# Altium schematic sheet DiffMeasure.SchDoc
size A4
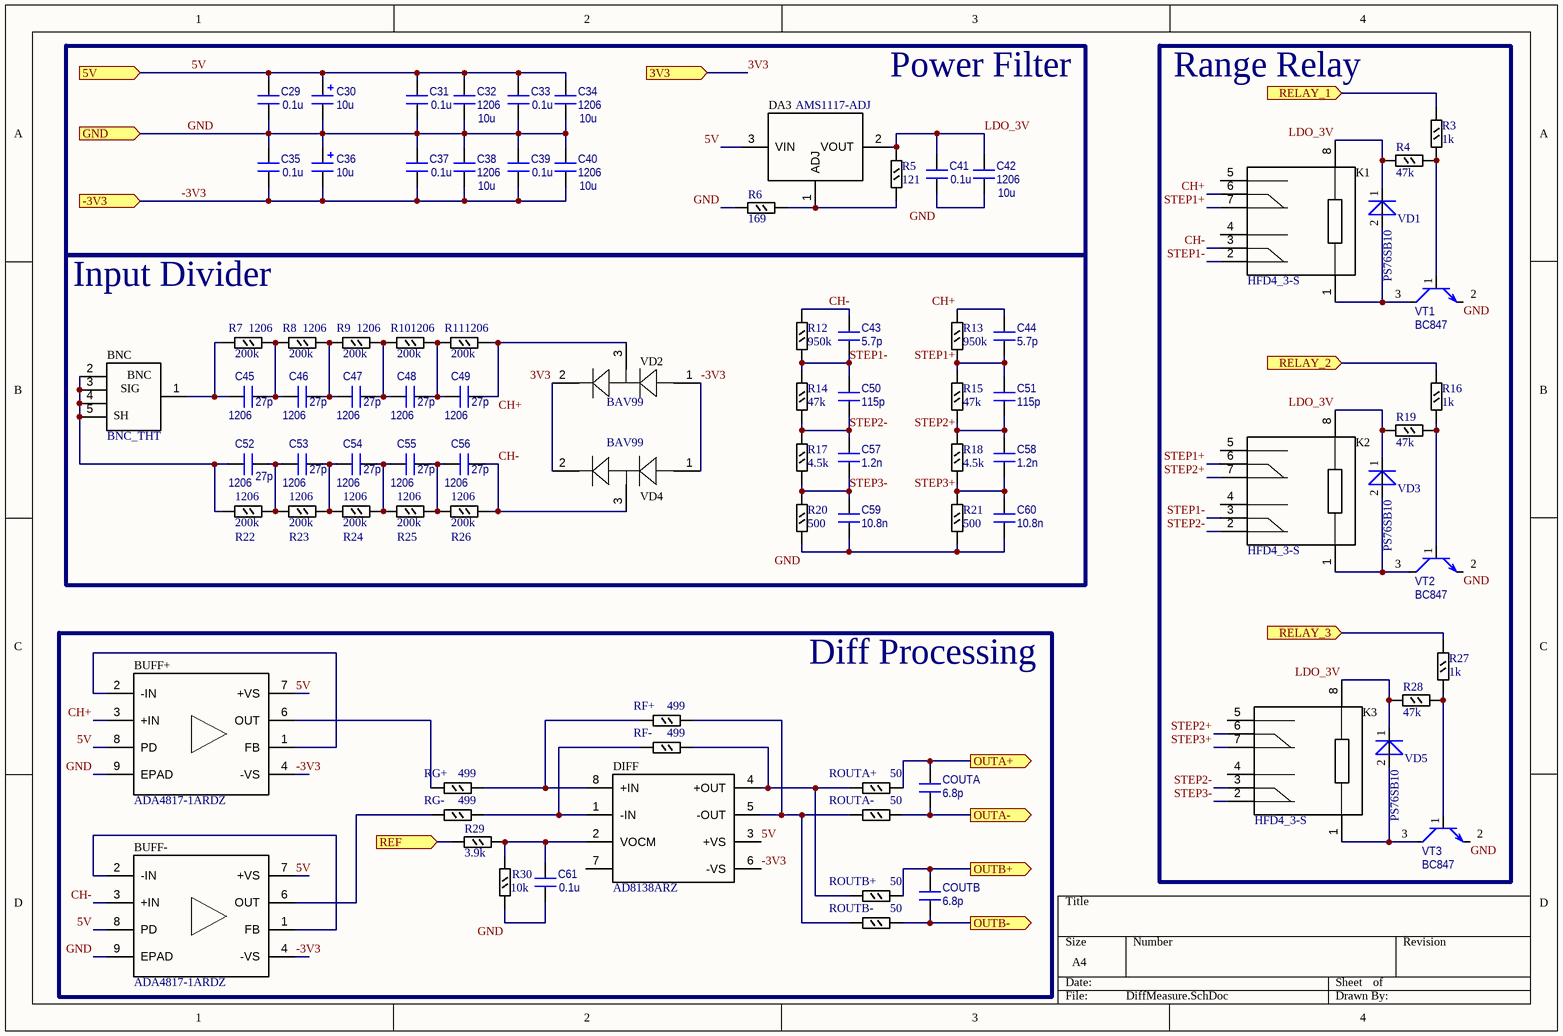
[diagram p0: DiffMeasure.SchDoc]

## Parts
BNC  BNC_THT  [BNC_VERTICAL_THT_5PIN]
BUFF+  ADA4817-1ARDZ  [ADA4817-1ARDZ_SOIC8_EP]
BUFF-  ADA4817-1ARDZ  [ADA4817-1ARDZ_SOIC8_EP]
C29  value 0.1u  [CAPC2012(0805)N]
C30  10u  [CAPMP7343X310N]
C31  value 0.1u  [CAPC2012(0805)N]
C32  value 10u  Package: 1206  [CAP_CER_1206]  (hidden comment: 2700p 50V)
C33  value 0.1u  [CAPC2012(0805)N]
C34  value 10u  Package: 1206  [CAP_CER_1206]  (hidden comment: 2700p 50V)
C35  value 0.1u  [CAPC2012(0805)N]
C36  10u  [CAPMP7343X310N]
C37  value 0.1u  [CAPC2012(0805)N]
C38  value 10u  Package: 1206  [CAP_CER_1206]  (hidden comment: 2700p 50V)
C39  value 0.1u  [CAPC2012(0805)N]
C40  value 10u  Package: 1206  [CAP_CER_1206]  (hidden comment: 2700p 50V)
C41  value 0.1u  [CAPC2012(0805)N]
C42  value 10u  Package: 1206  [CAP_CER_1206]  (hidden comment: 2700p 50V)
C43  value 5.7p  [CAPC2012(0805)N]
C44  value 5.7p  [CAPC2012(0805)N]
C45  value 27p  Package: 1206  [CAP_CER_1206]  (hidden comment: 2700p 50V)
C46  value 27p  Package: 1206  [CAP_CER_1206]  (hidden comment: 2700p 50V)
C47  value 27p  Package: 1206  [CAP_CER_1206]  (hidden comment: 2700p 50V)
C48  value 27p  Package: 1206  [CAP_CER_1206]  (hidden comment: 2700p 50V)
C49  value 27p  Package: 1206  [CAP_CER_1206]  (hidden comment: 2700p 50V)
C50  value 115p  [CAPC2012(0805)N]
C51  value 115p  [CAPC2012(0805)N]
C52  value 27p  Package: 1206  [CAP_CER_1206]  (hidden comment: 2700p 50V)
C53  value 27p  Package: 1206  [CAP_CER_1206]  (hidden comment: 2700p 50V)
C54  value 27p  Package: 1206  [CAP_CER_1206]  (hidden comment: 2700p 50V)
C55  value 27p  Package: 1206  [CAP_CER_1206]  (hidden comment: 2700p 50V)
C56  value 27p  Package: 1206  [CAP_CER_1206]  (hidden comment: 2700p 50V)
C57  value 1.2n  [CAPC2012(0805)N]
C58  value 1.2n  [CAPC2012(0805)N]
C59  value 10.8n  [CAPC2012(0805)N]
C60  value 10.8n  [CAPC2012(0805)N]
C61  value 0.1u  [CAPC2012(0805)N]
COUTA  value 6.8p  [CAPC2012(0805)N]
COUTB  value 6.8p  [CAPC2012(0805)N]
DA3  AMS1117-ADJ  [AMS1117-ADJ_SOT223]
DIFF  AD8138ARZ  [AD8138ARZ_SOIC8]
K1  HFD4_3-S  [HFD4_3_S_SMT]
K2  HFD4_3-S  [HFD4_3_S_SMT]
K3  HFD4_3-S  [HFD4_3_S_SMT]
R3  1k  [RESC2012(0805)N]
R4  47k  [RESC2012(0805)N]
R5  121  [RESC2012(0805)N]
R6  169  [RESC2012(0805)N]
R7  200k  Package: 1206  [R_1206]
R8  200k  Package: 1206  [R_1206]
R9  200k  Package: 1206  [R_1206]
R10  200k  Package: 1206  [R_1206]
R11  200k  Package: 1206  [R_1206]
R12  950k  [RESC2012(0805)N]
R13  950k  [RESC2012(0805)N]
R14  47k  [RESC2012(0805)N]
R15  47k  [RESC2012(0805)N]
R16  1k  [RESC2012(0805)N]
R17  4.5k  [RESC2012(0805)N]
R18  4.5k  [RESC2012(0805)N]
R19  47k  [RESC2012(0805)N]
R20  500  [RESC2012(0805)N]
R21  500  [RESC2012(0805)N]
R22  200k  Package: 1206  [R_1206]
R23  200k  Package: 1206  [R_1206]
R24  200k  Package: 1206  [R_1206]
R25  200k  Package: 1206  [R_1206]
R26  200k  Package: 1206  [R_1206]
R27  1k  [RESC2012(0805)N]
R28  47k  [RESC2012(0805)N]
R29  3.9k  [RESC2012(0805)N]
R30  10k  [RESC2012(0805)N]
RF+  499  [RESC2012(0805)N]
RF-  499  [RESC2012(0805)N]
RG+  499  [RESC2012(0805)N]
RG-  499  [RESC2012(0805)N]
ROUTA+  50  [RESC2012(0805)N]
ROUTA-  50  [RESC2012(0805)N]
ROUTB+  50  [RESC2012(0805)N]
ROUTB-  50  [RESC2012(0805)N]
VD1  PS76SB10  [SOD323]
VD2  BAV99  [BAV99_SOT23]
VD3  PS76SB10  [SOD323]
VD4  BAV99  [BAV99_SOT23]
VD5  PS76SB10  [SOD323]
VT1  BC847  [SOT23-3N]
VT2  BC847  [SOT23-3N]
VT3  BC847  [SOT23-3N]

## Blocks framed on the sheet
Power Filter: C29-C42 DA3 R5 R6
Range Relay: K1-K3 R3 R4 R16 R19 R27 R28 VD1 VD3 VD5 VT1-VT3
Input Divider: BNC C43-C60 R7-R15 R17 R18 R20-R26 VD2 VD4
Diff Processing: BUFF+ BUFF- C61 COUTA COUTB DIFF R29 R30 RF+ RF- RG+ RG- ROUTA+ ROUTA- ROUTB+ ROUTB-

## Ports
3V3 (in), 5V (in), -3V3 (in), GND (in), OUTA+ (out), OUTA- (out), OUTB+ (out), OUTB- (out), REF (in), RELAY_1 (in), RELAY_2 (in), RELAY_3 (in)

## Nets
3V3: VD2.2(K2) VD4.2(K2) ; port 3V3
5V: BUFF+.7(+VS) BUFF+.8(PD) BUFF-.7(+VS) BUFF-.8(PD) C29.1 C30.1 C31.1 C32.1 C33.1 C34.1 DA3.3(VIN) DIFF.3(+VS) ; port 5V
-3V3: BUFF+.4(-VS) BUFF-.4(-VS) C35.2 C36.2 C37.2 C38.2 C39.2 C40.2 DIFF.6(-VS) VD2.1(A1) VD4.1(A1) ; port -3V3
CH+: BUFF+.3(+IN) C44.1 C49.2 K1.6 R11.2 R13.2 VD2.3(K1_A2)
CH-: BUFF-.3(+IN) C43.1 C56.2 K1.3 R12.2 R26.2 VD4.3(K1_A2)
GND: BUFF+.9(EPAD) BUFF-.9(EPAD) C29.2 C30.2 C31.2 C32.2 C33.2 C34.2 C35.1 C36.1 C37.1 C38.1 C39.1 C40.1 C41.2 C42.2 C59.2 C60.2 C61.2 R6.1 R20.1 R21.1 R30.2 VT1.2(E) VT2.2(E) VT3.2(E) ; port GND
LDO_3V: C41.1 C42.1 DA3.2(VOUT) K1.8(COIL-) K2.8(COIL-) K3.8(COIL-) R4.2 R5.1 R19.2 R28.2 VD1.1(C) VD3.1(C) VD5.1(C)
OUTA+: COUTA.1 ROUTA+.2 ; port OUTA+
OUTA-: COUTA.2 ROUTA-.2 ; port OUTA-
OUTB+: COUTB.1 ROUTB+.2 ; port OUTB+
OUTB-: COUTB.2 ROUTB-.2 ; port OUTB-
REF: R29.1 ; port REF
RELAY_1: R3.1 ; port RELAY_1
RELAY_2: R16.1 ; port RELAY_2
RELAY_3: R27.1 ; port RELAY_3
STEP1+: C44.2 C51.1 K1.7 K2.6 R13.1 R15.2
STEP1-: C43.2 C50.1 K1.2 K2.3 R12.1 R14.2
STEP2+: C51.2 C58.1 K2.7 K3.6 R15.1 R18.2
STEP2-: C50.2 C57.1 K2.2 K3.3 R14.1 R17.2
STEP3+: C58.2 C60.1 K3.7 R18.1 R21.2
STEP3-: C57.2 C59.1 K3.2 R17.1 R20.2
NetBNC_1: BNC.1(SIGNAL) C45.1 R7.1
NetBNC_2: BNC.2(SHIELD) BNC.3(SHIELD) BNC.4(SHIELD) BNC.5(SHIELD) C52.1 R22.1
NetBUFF+_1: BUFF+.1(FB) BUFF+.2(-IN)
NetBUFF+_6: BUFF+.6(OUT) RG+.1
NetBUFF-_1: BUFF-.1(FB) BUFF-.2(-IN)
NetBUFF-_6: BUFF-.6(OUT) RG-.1
NetC45_2: C45.2 C46.1 R7.2 R8.1
NetC46_2: C46.2 C47.1 R8.2 R9.1
NetC47_2: C47.2 C48.1 R9.2 R10.1
NetC48_2: C48.2 C49.1 R10.2 R11.1
NetC52_2: C52.2 C53.1 R22.2 R23.1
NetC53_2: C53.2 C54.1 R23.2 R24.1
NetC54_2: C54.2 C55.1 R24.2 R25.1
NetC55_2: C55.2 C56.1 R25.2 R26.1
NetC61_1: C61.1 DIFF.2(VOCM) R29.2 R30.1
NetDA3_1: DA3.1(ADJ) R5.2 R6.2
NetDIFF_1: DIFF.1(-IN) RF-.1 RG-.2
NetDIFF_4: DIFF.4(+OUT) RF-.2 ROUTA+.1 ROUTB+.1
NetDIFF_5: DIFF.5(-OUT) RF+.2 ROUTA-.1 ROUTB-.1
NetDIFF_8: DIFF.8(+IN) RF+.1 RG+.2
NetK1_1: K1.1(COIL+) VD1.2(A) VT1.3(C)
NetK2_1: K2.1(COIL+) VD3.2(A) VT2.3(C)
NetK3_1: K3.1(COIL+) VD5.2(A) VT3.3(C)
NetR3_2: R3.2 R4.1 VT1.1(B)
NetR16_2: R16.2 R19.1 VT2.1(B)
NetR27_2: R27.2 R28.1 VT3.1(B)

Not connected (* = marked no-connect by the designer): DIFF 7; K1 4 5; K2 4 5; K3 4 5

## Notes on the sheet
- (in symbol BNC_VERTICAL_THT) SIG; SH

## Library data of the parts
BNC = BNC_VERTICAL_THT: Generic vertical BNC jack, five through-hole terminals
BUFF+ BUFF- = ADA4817-1ARDZ: ADI ADA4817-1ARDZ FastFET op amp, RD-8-4 SOIC-8 with EP
C29 C31 C33 C35 C37 C39 C41 C43 C44 C50 C51 C57-C61 COUTA COUTB = CAPC2012(0805): Package: 0805; Voltage: *; Part Number: CAPC2012(0805)
C30 C36 = CapTantD: Part Number: CapTantD
C32 C34 C38 C40 C42 C45-C49 C52-C56 = 12065A272GAT2A: Cap Cer MLCC SMD 50V 2700p C0G NP0 1206 2%; Voltage: *; Part Number: 12065A272GAT2A; MPN: 12065A272GAT2A; Mouser Part Number: 581-12065A272G; HelpURL: https://eu.mouser.com/ProductDetail/AVX/12065A272GAT2A?qs=ZdaRgelF1GpUV998NMwU6A%3D%3D
DA3 = AMS1117-ADJ: AMS1117 adjustable voltage regulator, SOT-223; tab = VOUT
DIFF = AD8138ARZ: ADI AD8138ARZ low distortion differential ADC driver, SOIC-8 R-8
K1-K3 = HFD4_3-S: Hongfa HFD4/3-S monostable DPDT relay, standard SMT terminal
R3-R30 RF+ RF- RG+ RG- ROUTA+ ROUTA- ROUTB+ ROUTB- = RESC2012(0805): Part Number: RESC2012(0805)
  R3-R6 R12-R21 R27-R30 RF+ RF- RG+ RG- ROUTA+ ROUTA- ROUTB+ ROUTB-: Package: 0805
VD1 VD3 VD5 = BAT54J: Schottky Diode 30V 0,2A  SOD-323-2; Part Number: BAT54J; Manufacturer Part Number: BAT54J,115; Published: 8-Jun-2000; LatestRevisionDate: 17-Jul-2002; LatestRevisionNote: Re-released for DXP Platform.; DatasheetVersion: 1997; PackageReference: DO-35; Publisher: Altium Limited; PackageDescription: Diode, Axial; Body 3.8 x 1.9 mm (LxDia. max), Lead Dia. 0.53 mm (max); Code_JEDEC: DO-204-AH; ComponentLink1Description: Manufacturer Link; ComponentLink1URL: http://www.fairchildsemi.com/; ComponentLink2Description: Datasheet; ComponentLink2URL: http://www.fairchildsemi.com/ds/1N%2F1N4148.pdf; HelpURL: https://eu.mouser.com/ProductDetail/Nexperia/BAT54J115?qs=me8TqzrmIYVxNBNrx1zKWQ%3D%3D; Price$: 0.06; Mouser Part Number: 771-BAT54J115
VD2 VD4 = BAV99: Nexperia BAV99 dual series diode, SOT23
VT1-VT3 = BC848: Part Number: BC848; HelpURL: http://www.nxp.com/documents/data_sheet/BC848_SER.pdf